# EAGLE design Sch1 (EAGLE 7.0.0)
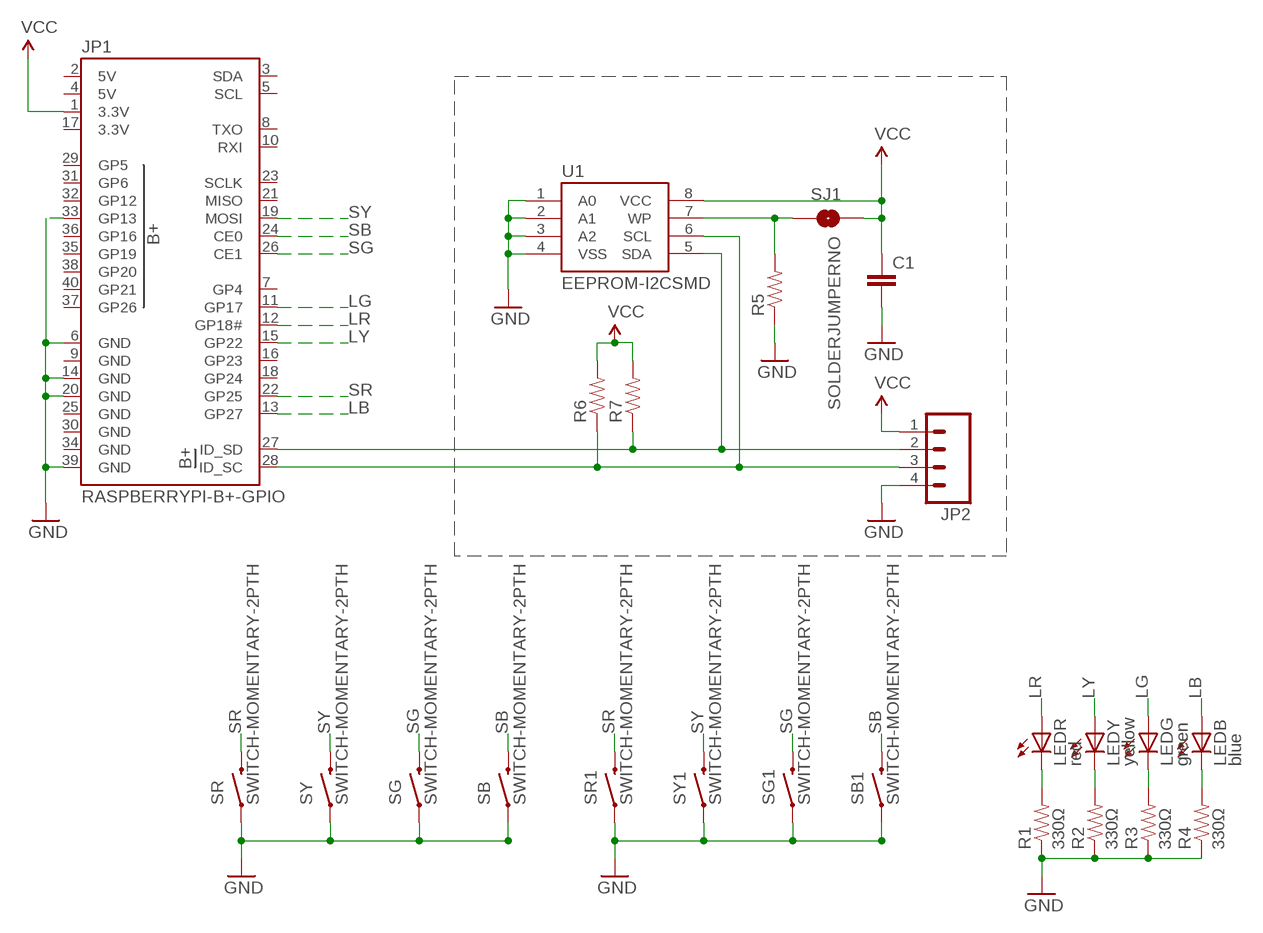
[diagram p0: schematic, sheet 1]

## Parts
C1  CAP0805  [0805]
JP1  RASPBERRYPI-B+-GPIO  [2X20-SHROUDED]
JP2  M04PTH  [1X04]
LEDB  blue  LED5MM  [LED5MM]
LEDG  green  LED5MM  [LED5MM]
LEDR  red  LED5MM  [LED5MM]
LEDY  yellow  LED5MM  [LED5MM]
R1  330Ω  RESISTORPTH-1/4W  [AXIAL-0.4]
R2  330Ω  RESISTORPTH-1/4W  [AXIAL-0.4]
R3  330Ω  RESISTORPTH-1/4W  [AXIAL-0.4]
R4  330Ω  RESISTORPTH-1/4W  [AXIAL-0.4]
R5  RESISTOR0805-RES  [0805]
R6  RESISTOR0805-RES  [0805]
R7  RESISTOR0805-RES  [0805]
SB  SWITCH-MOMENTARY-2PTH  [TACTILE-PTH]
SB1  SWITCH-MOMENTARY-2PTH  [TACTILE-PTH]
SG  SWITCH-MOMENTARY-2PTH  [TACTILE-PTH]
SG1  SWITCH-MOMENTARY-2PTH  [TACTILE-PTH]
SJ1  SOLDERJUMPERNO  [SJ_2S-NO]
SR  SWITCH-MOMENTARY-2PTH  [TACTILE-PTH]
SR1  SWITCH-MOMENTARY-2PTH  [TACTILE-PTH]
SY  SWITCH-MOMENTARY-2PTH  [TACTILE-PTH]
SY1  SWITCH-MOMENTARY-2PTH  [TACTILE-PTH]
U1  EEPROM-I2CSMD  [SO08]

## Nets
GND: C1.2 JP1.6(GND) JP1.14(GND) JP1.20(GND) JP1.33(GP13) JP1.39(GND) JP2.4 R1.P$1 R2.P$1 R3.P$1 R4.P$1 R5.1 SB1.1 SB.1 SG1.1 SG.1 SR1.1 SR.1 SY1.1 SY.1 U1.1(A0) U1.2(A1) U1.3(A2) U1.4(VSS)
LB: JP1.13(GP27) LEDB.A
LG: JP1.11(GP17) LEDG.A
LR: JP1.12(GP18#) LEDR.A
LY: JP1.15(GP22) LEDY.A
N$1: LEDR.K(C) R1.P$2
N$2: LEDY.K(C) R2.P$2
N$3: LEDG.K(C) R3.P$2
N$4: LEDB.K(C) R4.P$2
N$5: JP1.27(ID_SD) JP2.2 R7.1 U1.5(SDA)
N$6: JP1.28(ID_SC) JP2.3 R6.1 U1.6(SCL)
N$8: R5.2 SJ1.1 U1.7(WP)
SB: JP1.24(CE0) SB1.3 SB.3
SG: JP1.26(CE1) SG1.3 SG.3
SR: JP1.22(GP25) SR1.3 SR.3
SY: JP1.19(MOSI) SY1.3 SY.3
VCC: C1.1 JP1.1(3.3V) JP2.1 R6.2 R7.2 SJ1.2 U1.8(VCC)
Unconnected: JP1.3(SDA) JP1.5(SCL) JP1.7(GP4) JP1.8(TXO) JP1.10(RXI) JP1.16(GP23) JP1.18(GP24) JP1.21(MISO) JP1.23(SCLK) JP1.29(GP5) JP1.31(GP6) JP1.32(GP12) JP1.35(GP19) JP1.36(GP16) JP1.37(GP26) JP1.38(GP20) JP1.40(GP21)

## Power pins joined to a net without a drawn wire
3.3V: JP1.17(3.3V)
5V: JP1.2(5V) JP1.4(5V)
GND: JP1.9(GND) JP1.25(GND) JP1.30(GND) JP1.34(GND)

## Library data of the parts
C1 = SparkFun-Passives:CAP: Capacitor Standard 0603 ceramic capacitor, and 0.1" leaded capacitor.
JP1 = SparkFun-Boards:RASPBERRYPI-B+-GPIO: Raspberry Pi B+ GPIO Header 2x20 pin connector
JP2 = SparkFun-Connectors:M04: Header 4 Standard 4-pin 0.1" header. Use with straight break away headers (SKU : PRT-00116), right angle break away headers (PRT-00553), swiss pins (PRT-00743), machine pins (PRT-00117), and female headers (PRT-00115). Molex polarized connector foot print use with SKU : PRT-08231 with associated crimp pins and housings. 1MM SMD Version SKU: PRT-10208
LEDB LEDG LEDR LEDY = adafruit:LED: LED OSRAM: - CHIPLED LG R971, LG N971, LY N971, LG Q971, LY Q971, LO R971, LY R971 LH N974, LH R974 LS Q976, LO Q976, LY Q976 LO Q996 - Hyper CHIPLED LW Q18S LB Q993, LB Q99A, LB R99A - SideLED LS A670, LO A670, LY A670, LG A670, LP A670 LB A673, LV A673, LT A673, LW A673 LH A674 LY A675 LS A676, LA A676, LO A676, LY A676, LW A676 LS A679, LY A679, LG A679 - Hyper Micro SIDELED® LS Y876, LA Y876, LO Y876, LY Y876 LT Y87S - SmartLED LW L88C, LW L88S LB L89C, LB L89S, LG L890 LS L89K, LO L89K, LY L89K LS L896, LA L896, LO L896, LY L896 - TOPLED LS T670, LO T670, LY T670, LG T670, LP T670 LSG T670, LSP T670, LSY T670, LOP T670, LYG T670 LG T671, LOG T671, LSG T671 LB T673, LV T673, LT T673, LW T673 LH T674 LS T676, LA T676, LO T676, LY T676, LB T676, LH T676, LSB T676, LW T676 LB T67C, LV T67C, LT T67C, LS T67K, LO T67K, LY T67K, LW E67C LS E67B, LA E67B, LO E67B, LY E67B, LB E67C, LV E67C, LT E67C LW T67C LS T679, LY T679, LG T679 LS T770, LO T770, LY T770, LG T770, LP T770 LB T773, LV T773, LT T773, LW T773 LH T774 LS E675, LA E675, LY E675, LS T675 LS T776, LA T776, LO T776, LY T776, LB T776 LHGB T686 LT T68C, LB T68C - Hyper Mini TOPLED® LB M676 - Mini TOPLED Santana® LG M470 LS M47K, LO M47K, LY M47K Source: http://www.osram.convergy.de/
R1-R7 = SparkFun-Passives:RESISTOR: Resistor Basic schematic elements and footprints for 0603, 1206, and PTH resistors.
SB SB1 SG SG1 SR SR1 SY SY1 = SparkFun-Electromechanical:SWITCH-MOMENTARY-2: Various NO switches- pushbuttons, reed, etc
SJ1 = SparkFun-Retired:SOLDERJUMPER: Solder Jumper Standard SMD solder jumper. Used to automate production. Two varients : Normally Open and Normally Closed are the same, but have different paste layers. NC will have a large amount of paste and should jumper during reflow.
U1 = SparkFun-DigitalIC:EEPROM-I2C: I2C EEPROM chips, 24LC256 (and others)

## Board
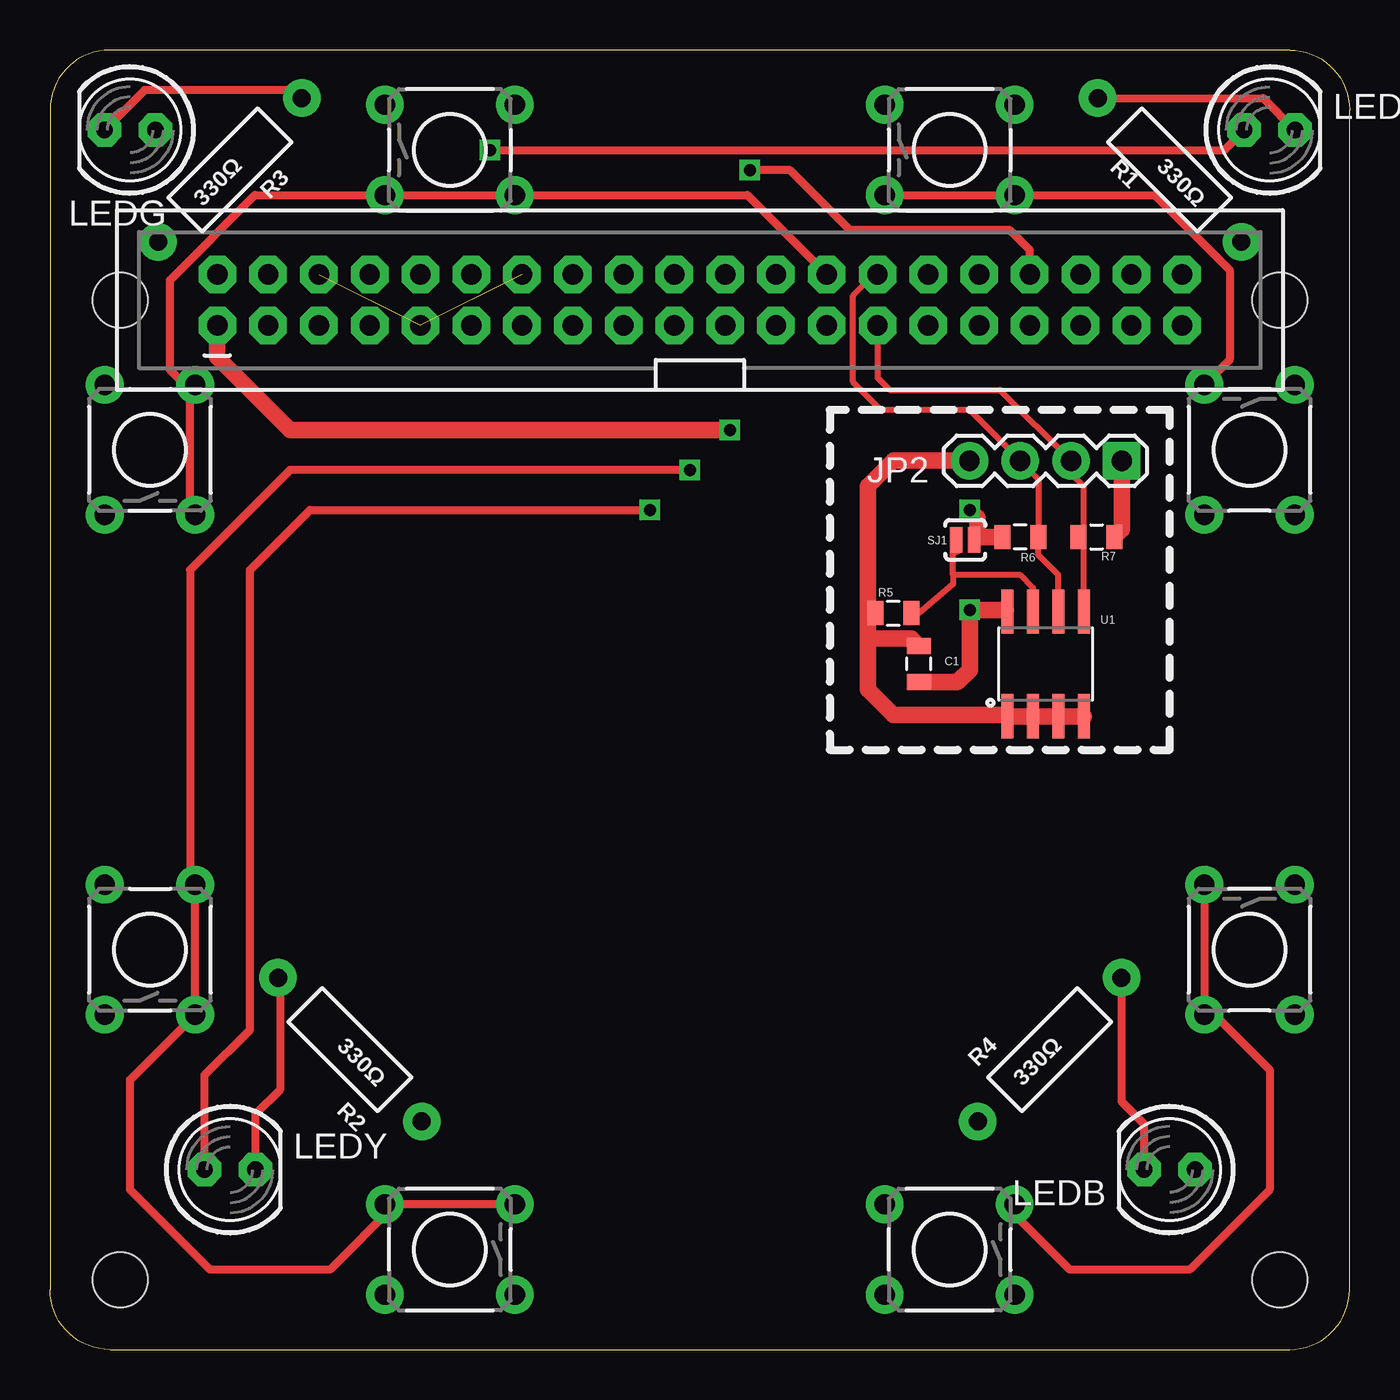
[diagram p1: board, top side]
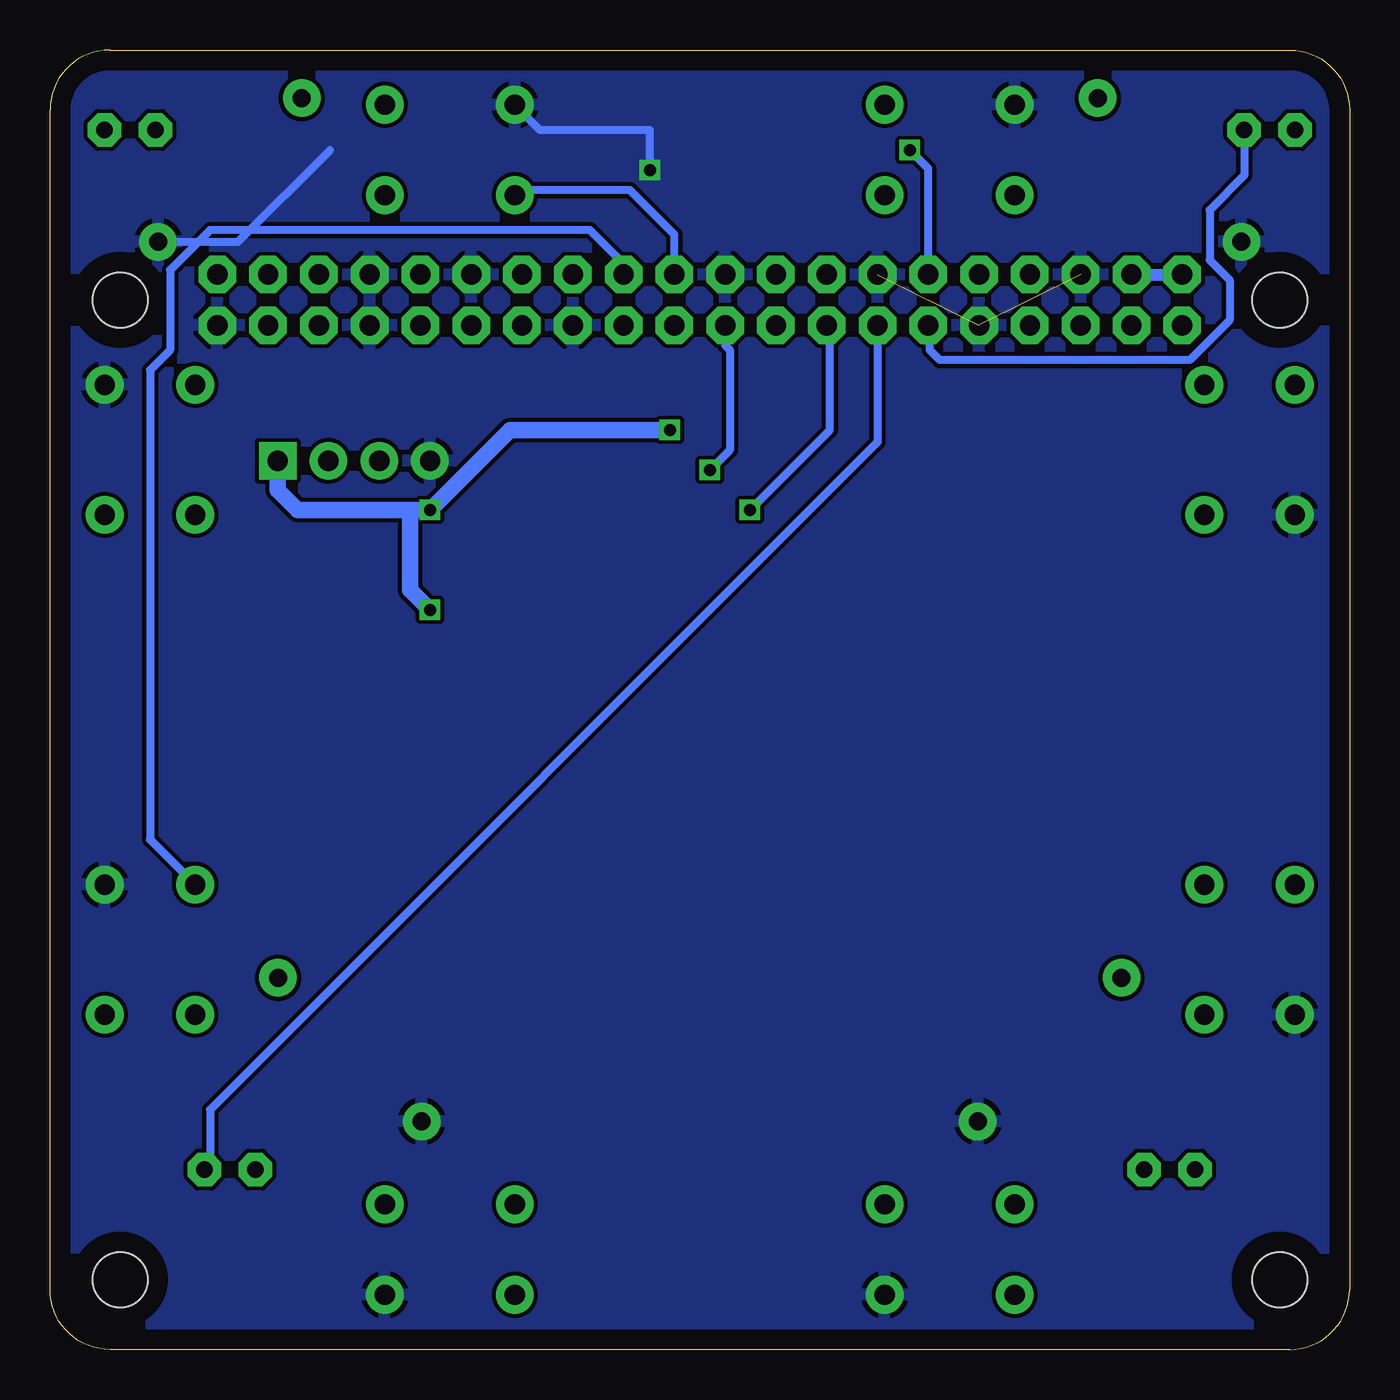
[diagram p2: board, bottom side, seen from below]

Size 65 x 65 mm. Coordinates in mm from the lower left corner, seen from the top.
Outline: 3,0 62,0 arc90 65,3 65,62 arc90 62,65 3,65 arc90 0,62 0,3 arc90 3,0
Copper layers (1*16): Top 0.035mm / dielectric 1.5mm / Bottom 0.035mm
Design rules "default": minimum track width 10mil, minimum drill 24mil, track to track 8mil, track to pad 8mil, pad to pad 8mil, via to via 8mil, smd to smd 8mil, copper to edge 40mil, drill to drill 8mil, minimum pad ring 10mil, minimum via ring 8mil, stop-mask expansion 4mil, vias tented up to drill 0mil, thermal gap 10mil
Holes 2.75 mm at 3.5,3.5 61.5,3.5 3.5,52.5 61.5,52.5

### Footprints (pad centres in the part's own frame; a part is rotated, then mirrored left to right if it is on the bottom)
0805 = smd 0.8 x 1.2: 1 -0.9,0; 2 0.9,0
2X20-SHROUDED = drill 1.016 pad 1.88 octagon: 1 -1.27,24.13; 2 1.27,24.13; 3 -1.27,21.59; 4 1.27,21.59; 5 -1.27,19.05; 6 1.27,19.05; 7 -1.27,16.51; 8 1.27,16.51; 9 -1.27,13.97; 10 1.27,13.97; 11 -1.27,11.43; 12 1.27,11.43; 13 -1.27,8.89; 14 1.27,8.89; 15 -1.27,6.35; 16 1.27,6.35; 17 -1.27,3.81; 18 1.27,3.81; 19 -1.27,1.27; 20 1.27,1.27; 21 -1.27,-1.27; 22 1.27,-1.27; 23 -1.27,-3.81; 24 1.27,-3.81; 25 -1.27,-6.35; 26 1.27,-6.35; 27 -1.27,-8.89; 28 1.27,-8.89; 29 -1.27,-11.43; 30 1.27,-11.43; 31 -1.27,-13.97; 32 1.27,-13.97; 33 -1.27,-16.51; 34 1.27,-16.51; 35 -1.27,-19.05; 36 1.27,-19.05; 37 -1.27,-21.59; 38 1.27,-21.59; 39 -1.27,-24.13; 40 1.27,-24.13
1X04 = drill 1.016 pad 1.88 square: 1 0,0 | drill 1.016 pad 1.88: 2 2.54,0; 3 5.08,0; 4 7.62,0
LED5MM = drill 0.813 pad 1.676 octagon: A -1.27,0; K 1.27,0
AXIAL-0.4 = drill 0.9 pad 1.88: P$1 -5.08,0; P$2 5.08,0
TACTILE-PTH = drill 1.016 pad 1.88: 1 -3.251,2.261; 2 3.251,2.261; 3 -3.251,-2.261; 4 3.251,-2.261
SJ_2S-NO = smd 0.635 x 1.27: 1 -0.45,0; 2 0.45,0
SO08 = smd 0.61 x 2.21: 1 -1.905,-2.616; 2 -0.635,-2.616; 3 0.635,-2.616; 4 1.905,-2.616; 5 1.905,2.616; 6 0.635,2.616; 7 -0.635,2.616; 8 -1.905,2.616

### Placement (x,y rotation side)
C1  43.45,34.29 90 top
JP1  32.5,52.5 90 top
JP2  53.61,44.45 180 top
LEDB  56,9 180 top
LEDG  4,61 180 top
LEDR  61,61 0 top
LEDY  9,9 0 top
R1  56,59 135 top
R2  15,15 135 top
R3  9,59 45 top
R4  50,15 45 top
R5  42.18,36.83 0 top
R6  48.53,40.64 180 top
R7  52.34,40.64 0 top
SB  45,5 180 top
SB1  60,20 270 top
SG  20,60 0 top
SG1  5,45 90 top
SJ1  45.78,40.49 0 top
SR  60,45 270 top
SR1  45,60 0 top
SY  20,5 180 top
SY1  5,20 90 top
U1  49.8,34.29 0 top

### Tracks (layer width: path | path; a pad name or v marks a point on that pad's centre or on a via)
5V
  Bottom 0.61: JP1.4 JP1.2
GND  (via drill 0.6)  (2 unrouted)
  Top 0.406: JP1.34 49.01,54.99 48,56 40,56 37,59 v35,59
  Top 0.61: U1.1 47.82,31.75 | R5.1 40.91,36.83
  Top 0.813: U1.1 U1.2 U1.3 U1.4 | 47.82,31.75 42.18,31.75 40.91,33.02 40.91,35.56 | 40.91,35.56 40.91,36.83 40.91,43.18 42.18,44.45 JP2.4 | C1.2 43.08,35.56 40.91,35.56
  Bottom 0.406: R1.P$1 55.59,55.41 51,60 | v35,59 35,61 40.49,61 SR1.1
  pour Bottom: 3,0 arc-90 0,3 0,62 arc-90 3,65 62,65 arc-90 65,62 65,3 arc-90 62,0
LB
  Bottom 0.406: JP1.13 23.61,45.39 57,12 57,9.27 LEDB.A
LG
  Bottom 0.406: LEDG.A 5.27,58.73 7,57 7,54.5 6,53.5 6,51.5 8,49.5 20.5,49.5 21,50 21,51.16 JP1.11
LR  (via drill 0.6)
  Top 0.406: v22,60 58.73,60 LEDR.A
  Bottom 0.406: JP1.12 21.07,59.07 v22,60
LY  (via drill 0.6)
  Top 0.406: LEDY.A 7.73,13.73 10,16 10,39 13,42 v30,42
  Bottom 0.406: v30,42 26,46 26,51.08 JP1.15
N$1
  Top 0.406: R1.P$2 60.68,62.59 LEDR.K
N$2
  Top 0.406: R2.P$2 11.5,18.59 11.5,13 10.27,11.77 LEDY.K
N$3
  Top 0.406: R3.P$2 12.18,63 4.73,63 LEDG.K
N$4
  Top 0.406: R4.P$2 53.59,12.41 54.73,11.27 LEDB.K
N$5
  Top 0.305: U1.5 51.7,40.38 R7.1 51.7,40.91 51.7,43.18 51.07,43.81 JP2.2 47.52,48 42,48 41.39,48.61 JP1.27
N$6
  Top 0.305: U1.6 50.44,38.73 49.43,39.74 R6.1 49.43,43.55 JP2.3 46,47 41.56,47 40.16,48.4 40.16,52.7 41.23,53.77 JP1.28
N$8
  Top 0.305: R5.2 43.45,36.83 45.17,38.28 45.17,38.73 | 45.17,38.73 45.17,39.83 45.5,40 SJ1.1 | U1.7 49.16,38.1 48.53,38.73 45.17,38.73
SB
  Top 0.406: SB1.3 57.74,17.26 61,14 61,8 57,4 51,4 48,7 48,7.01 SB.3
  Bottom 0.406: JP1.24 36.31,54.31 38,56 57,56 59,54 59,50 60,49 60,25.51 SB1.3
SG
  Top 0.406: SG1.3 7,42.01 7,48 6,49 6,53.5 10.24,57.74 SG.3 34.88,57.74 JP1.26
SR
  Top 0.406: SR1.3 55.26,57.74 59,54 59,49.51 SR.3
  Bottom 0.406: JP1.22 33.77,55.77 36,58 41.49,58 SR1.3
SY  (via drill 0.6)
  Top 0.406: SY.3 17.26,7.26 14,4 8,4 4,8 4,13.49 SY1.3 7.26,22.74 7,23 7,39 12,44 v32,44
  Bottom 0.406: JP1.19 31.23,50.23 31,50 31,45 v32,44
VCC  (via drill 0.6)
  Top 0.406: 47.8,37 U1.8 | 46.38,40.64 SJ1.2
  Top 0.813: R7.2 53.61,41.01 JP2.1 | JP1.1 8.37,49.63 12,46 v34,46 | C1.1 45.39,33.39 46,34 v46,37 47.8,37 | R6.2 46.38,40.64 46.38,41.62 v46,42
  Bottom 0.813: v34,46 42,46 v46,42 47,42 | 47,42 52.61,42 53.61,43 JP2.1 | v46,37 47,38 47,42